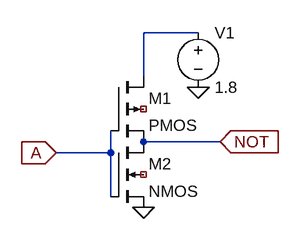
[diagram p0: schematic NOTagin.asc]
NOTagin.asc, the LTspice schematic file:
Version 4
SHEET 1 880 680
WIRE 272 -32 192 -32
WIRE 192 32 192 -32
WIRE 304 128 192 128
WIRE 144 144 144 112
WIRE 144 144 64 144
WIRE 144 208 144 144
FLAG 192 224 0
FLAG 64 144 A
IOPIN 64 144 In
FLAG 304 128 NOT
IOPIN 304 128 In
FLAG 272 48 0
SYMBOL pmos4 144 32 R0
SYMATTR InstName M1
SYMBOL nmos4 144 128 R0
SYMATTR InstName M2
SYMBOL voltage 272 -48 R0
WINDOW 123 0 0 Left 0
WINDOW 39 0 0 Left 0
SYMATTR InstName V1
SYMATTR Value 1.8

The netlist it stands for:
* NOTagin.asc
M1 N001 A NOT NC_01 PMOS
M2 NOT A 0 NC_02 NMOS
V1 N001 0 1.8
.model NMOS NMOS
.model PMOS PMOS
.lib standard.mos
.backanno
.end